# Altium schematic sheet main.SchDoc
size A4
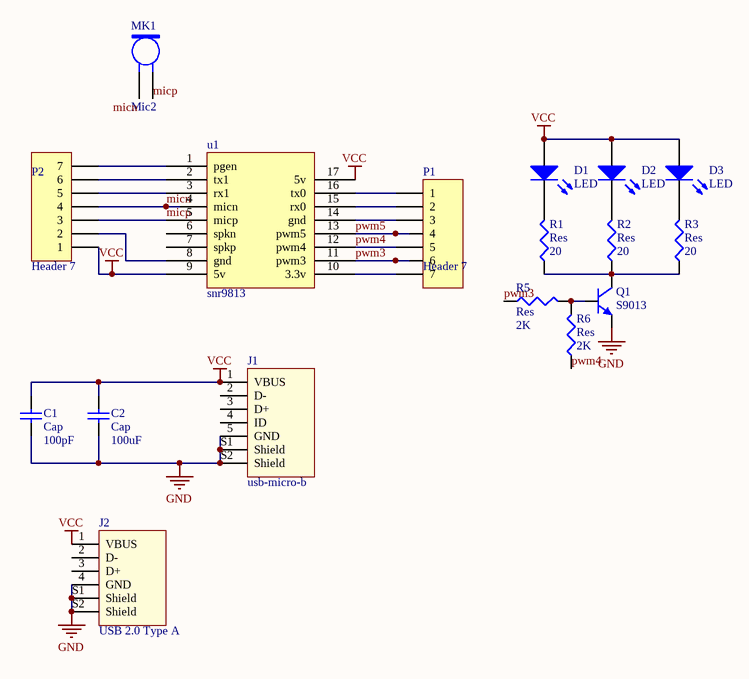
[diagram p0: main.SchDoc]

## Parts
C1  Cap  value 100pF  [C0805_N]
C2  Cap  value 100uF  [C0805_N]
D1  LED  [LED3528]
D2  LED  [LED3528]
D3  LED  [LED3528]
J1  usb-micro-b  [usb-micro-b]
J2  USB 2.0 Type A  [usb-a-mail]
MK1  Mic2  [PIN2]
P1  Header 7  [HDR1X7]
P2  Header 7  [HDR1X7]
Q1  Model: S9013  [SOT23-3_L]  (hidden comment: NPN)
R1  Res  value 20  [R0805_L]
R2  Res  value 20  [R0805_L]
R3  Res  value 20  [R0805_L]
R5  Res  value 2K  [R0805_M]
R6  Res  value 2K  [R0805_M]
u1  snr9813  [SNR9813M17]

## Nets
GND: C1.1 C2.1 J1.5(GND) J1.S1(Shield) J1.S2(Shield) J2.4(GND) J2.S1(Shield) J2.S2(Shield) Q1.2(E)
VCC: C1.2 C2.2 D1.1(A) D2.1(A) D3.1(A) J1.1(VBUS) J2.1(VBUS) P2.1 u1.9(5v) u1.17(5v)
micn: MK1.1 P2.4 u1.4(micn)
micp: MK1.2 P2.3 u1.5(micp)
pwm3: P1.6 R5.1 u1.11(pwm3)
pwm4: P1.5 R6.1 u1.12(pwm4)
pwm5: P1.4 u1.13(pwm5)
NetD1_2: D1.2(K) R1.2
NetD2_2: D2.2(K) R2.2
NetD3_2: D3.2(K) R3.2
NetP1_1: P1.1 u1.16(tx0)
NetP1_2: P1.2 u1.15(rx0)
NetP1_3: P1.3 u1.14(gnd)
NetP1_7: P1.7 u1.10(3.3v)
NetP2_2: P2.2 u1.8(gnd)
NetP2_5: P2.5 u1.3(rx1)
NetP2_6: P2.6 u1.2(tx1)
NetP2_7: P2.7 u1.1(pgen)
NetQ1_1: Q1.1(B) R5.2 R6.2
NetQ1_3: Q1.3(C) R1.1 R2.1 R3.1

Not connected (* = marked no-connect by the designer): J1 2(D-) 3(D+) 4(ID); J2 2(D-) 3(D+); u1 6(spkn) 7(spkp)

## Library data of the parts
C1 C2 = Cap: Capacitor; Published: 8-Jun-2000; LatestRevisionDate: 29-May-2009; LatestRevisionNote: IPC-7351 Footprint Added.; PackageReference: C1206; Publisher: Altium Limited; PackageDescription: Chip Capacitor
D1-D3 = LED: Typical LED; Published: 8-Jun-2000; LatestRevisionDate: 08-Jul-2005; LatestRevisionNote: Mech Layer 1 removed.; PackageReference: LED-0; Publisher: Altium Limited; PackageDescription: LED; 2 Leads
J2 = usb-a-male
MK1 = Mic2: Microphone; Published: 24-Mar-1999; LatestRevisionDate: 17-Jul-2002; LatestRevisionNote: Re-released for DXP Platform.; PackageReference: PIN2; Publisher: Altium Limited
P1 P2 = Header 7: Header, 7-Pin; LatestRevisionDate: 17-Jul-2002; LatestRevisionNote: Re-released for DXP Platform.; Publisher: Altium Limited
Q1 = NPN: NPN General Purpose Amplifier
R1-R3 R5 R6 = Res: Resistor; Published: 8-Jun-2000; LatestRevisionDate: 29-May-2009; LatestRevisionNote: IPC-7351 Footprint Added.; PackageReference: J1-0603; Publisher: Altium Limited; PackageDescription: Chip Resistor